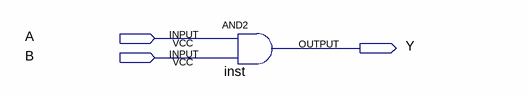
[diagram p0: schematic sheet]
// Quartus schematic fpga.bdf as structural Verilog: 1 symbols, 3 pins
module fpga (
  input  A,
  input  B,
  output Y
);

  and inst (Y, A, B);
endmodule
